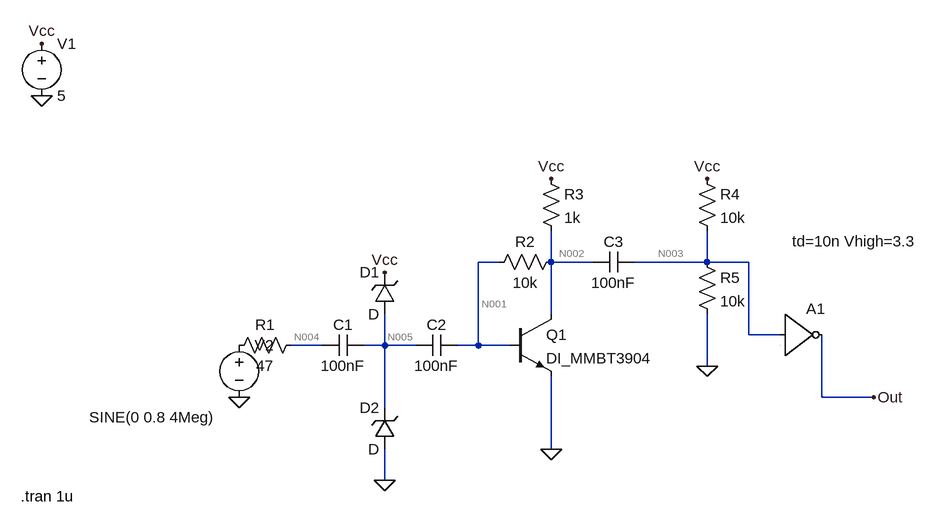
[diagram p0: schematic hf_eingang.asc]
hf_eingang.asc, the LTspice schematic file:
Version 4
SHEET 1 1380 680
WIRE 80 16 48 16
WIRE 160 16 160 -32
WIRE 224 16 160 16
WIRE 400 16 400 -32
WIRE 400 16 288 16
WIRE 464 16 400 16
WIRE 160 96 160 16
WIRE 464 128 464 16
WIRE 512 128 464 128
WIRE -192 144 -240 144
WIRE -96 144 -96 96
WIRE -96 144 -128 144
WIRE -48 144 -96 144
WIRE 48 144 48 16
WIRE 48 144 16 144
WIRE 96 144 48 144
WIRE 400 176 400 96
WIRE 576 224 576 128
WIRE 656 224 576 224
WIRE -96 240 -96 144
WIRE 160 304 160 192
WIRE -96 352 -96 304
FLAG -96 352 0
FLAG 160 304 0
FLAG 400 176 0
FLAG -624 -240 0
FLAG -624 -320 Vcc
FLAG -96 32 Vcc
FLAG 160 -112 Vcc
FLAG 400 -112 Vcc
FLAG -320 224 0
FLAG 656 224 Out
SYMBOL npn 96 96 R0
SYMATTR InstName Q1
SYMATTR Value DI_MMBT3904
SYMBOL res -224 128 R90
WINDOW 0 0 56 VBottom 2
WINDOW 3 32 56 VTop 2
SYMATTR InstName R1
SYMATTR Value 47
SYMBOL res 176 0 R90
WINDOW 0 0 56 VBottom 2
WINDOW 3 32 56 VTop 2
SYMATTR InstName R2
SYMATTR Value 10k
SYMBOL res 144 -128 R0
SYMATTR InstName R3
SYMATTR Value 1k
SYMBOL res 384 -128 R0
SYMATTR InstName R4
SYMATTR Value 10k
SYMBOL res 384 0 R0
SYMATTR InstName R5
SYMATTR Value 10k
SYMBOL cap -128 128 R90
WINDOW 0 0 32 VBottom 2
WINDOW 3 32 32 VTop 2
SYMATTR InstName C1
SYMATTR Value 100nF
SYMBOL cap 16 128 R90
WINDOW 0 0 32 VBottom 2
WINDOW 3 32 32 VTop 2
SYMATTR InstName C2
SYMATTR Value 100nF
SYMBOL cap 288 0 R90
WINDOW 0 0 32 VBottom 2
WINDOW 3 32 32 VTop 2
SYMATTR InstName C3
SYMATTR Value 100nF
SYMBOL voltage -624 -336 R0
WINDOW 123 0 0 Left 0
WINDOW 39 0 0 Left 0
SYMATTR InstName V1
SYMATTR Value 5
SYMBOL voltage -320 128 R0
WINDOW 3 -231 127 Left 2
WINDOW 123 24 44 Left 2
WINDOW 39 0 0 Left 0
SYMATTR Value SINE(0 0.8 4Meg)
SYMATTR InstName V2
SYMBOL Digital\\inv 512 64 R0
WINDOW 3 19 -80 Left 2
SYMATTR Value td=10n Vhigh=3.3
SYMATTR InstName A1
SYMBOL zener -80 96 R180
WINDOW 0 24 64 Left 2
WINDOW 3 24 0 Left 2
SYMATTR InstName D1
SYMBOL zener -80 304 R180
WINDOW 0 24 64 Left 2
WINDOW 3 24 0 Left 2
SYMATTR InstName D2
TEXT -656 376 Left 2 !.tran 1u

The netlist it stands for:
* hf_eingang.asc
Q1 N002 N001 0 0 DI_MMBT3904
R1 N004 P001 47
R2 N002 N001 10k
R3 Vcc N002 1k
R4 Vcc N003 10k
R5 N003 0 10k
C1 N005 N004 100nF
C2 N001 N005 100nF
C3 N003 N002 100nF
V1 Vcc 0 5
V2 P001 0 SINE(0 0.8 4Meg)
A1 N003 0 0 0 0 Out 0 0 BUF td=10n Vhigh=3.3
D1 N005 Vcc D
D2 0 N005 D
.model D D
.lib standard.dio
.model NPN NPN
.model PNP PNP
.lib standard.bjt
.tran 1u
.backanno
.end

* Results of the author's LTspice run, read from the files saved beside the schematic
* Operating Point, zero values left out:
*   V(n002) = 812 mV
*   V(n001) = 664.1 mV
*   V(vcc) = 5 V
*   V(n003) = 2.5 V
*   V(n005) = 2.5 V
*   Ic(Q1) = 4.173 mA
*   Ib(Q1) = 14.79 µA
*   Ie(Q1) = -4.188 mA
*   I(D1) = -2.51 pA
*   I(D2) = -2.51 pA
*   I(R2) = 14.79 µA
*   I(R3) = 4.188 mA
*   I(R4) = 250 µA
*   I(R5) = 250 µA
*   I(V1) = -4.438 mA
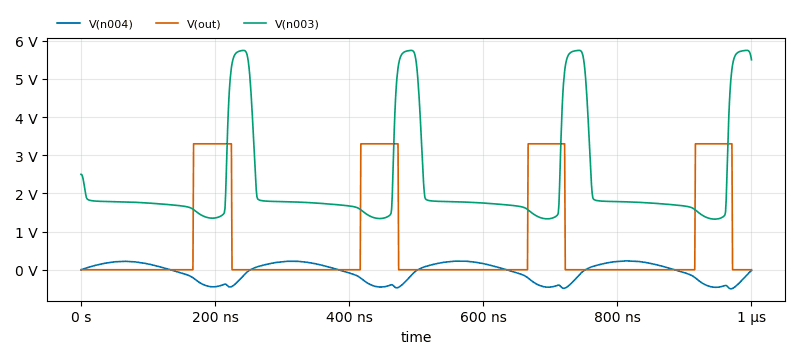
[diagram p1: Transient Analysis of hf_eingang.asc, plotted from the saved traces]
* Transient Analysis, 1 run:
*   V(n004): min -499.3 mV, max 232.6 mV, average -52.55 mV, rms 248.9 mV, last -22.44 mV
*   V(out): min 0 V, max 3.3 V, average 741.1 mV, rms 1.564 V, last 0 V
*   V(n003): min 1.326 V, max 5.749 V, average 2.273 V, rms 2.65 V, last 5.502 V